# Altium schematic sheet USB.SchDoc
size 594 x 420 mm; SheetNumber: 8; PageSetup: Record=PageOptions|CenterHorizontal=False|CenterVertical=False|PrintScale=0.43|XCorrection=0.00|YCorrection=0.00|PrintKind=1|BorderSize=5000000|LeftOffset=0|BottomOffset=0|Orientation=2|PaperLength=5940|PaperWidth=4200|Scale=100|PaperSource=7|PrintQuality=-4|MediaType=1|DitherType=10|PaperKind=Personal. 1: 215,9 x 279,4 mm|PrintScaleMode=0
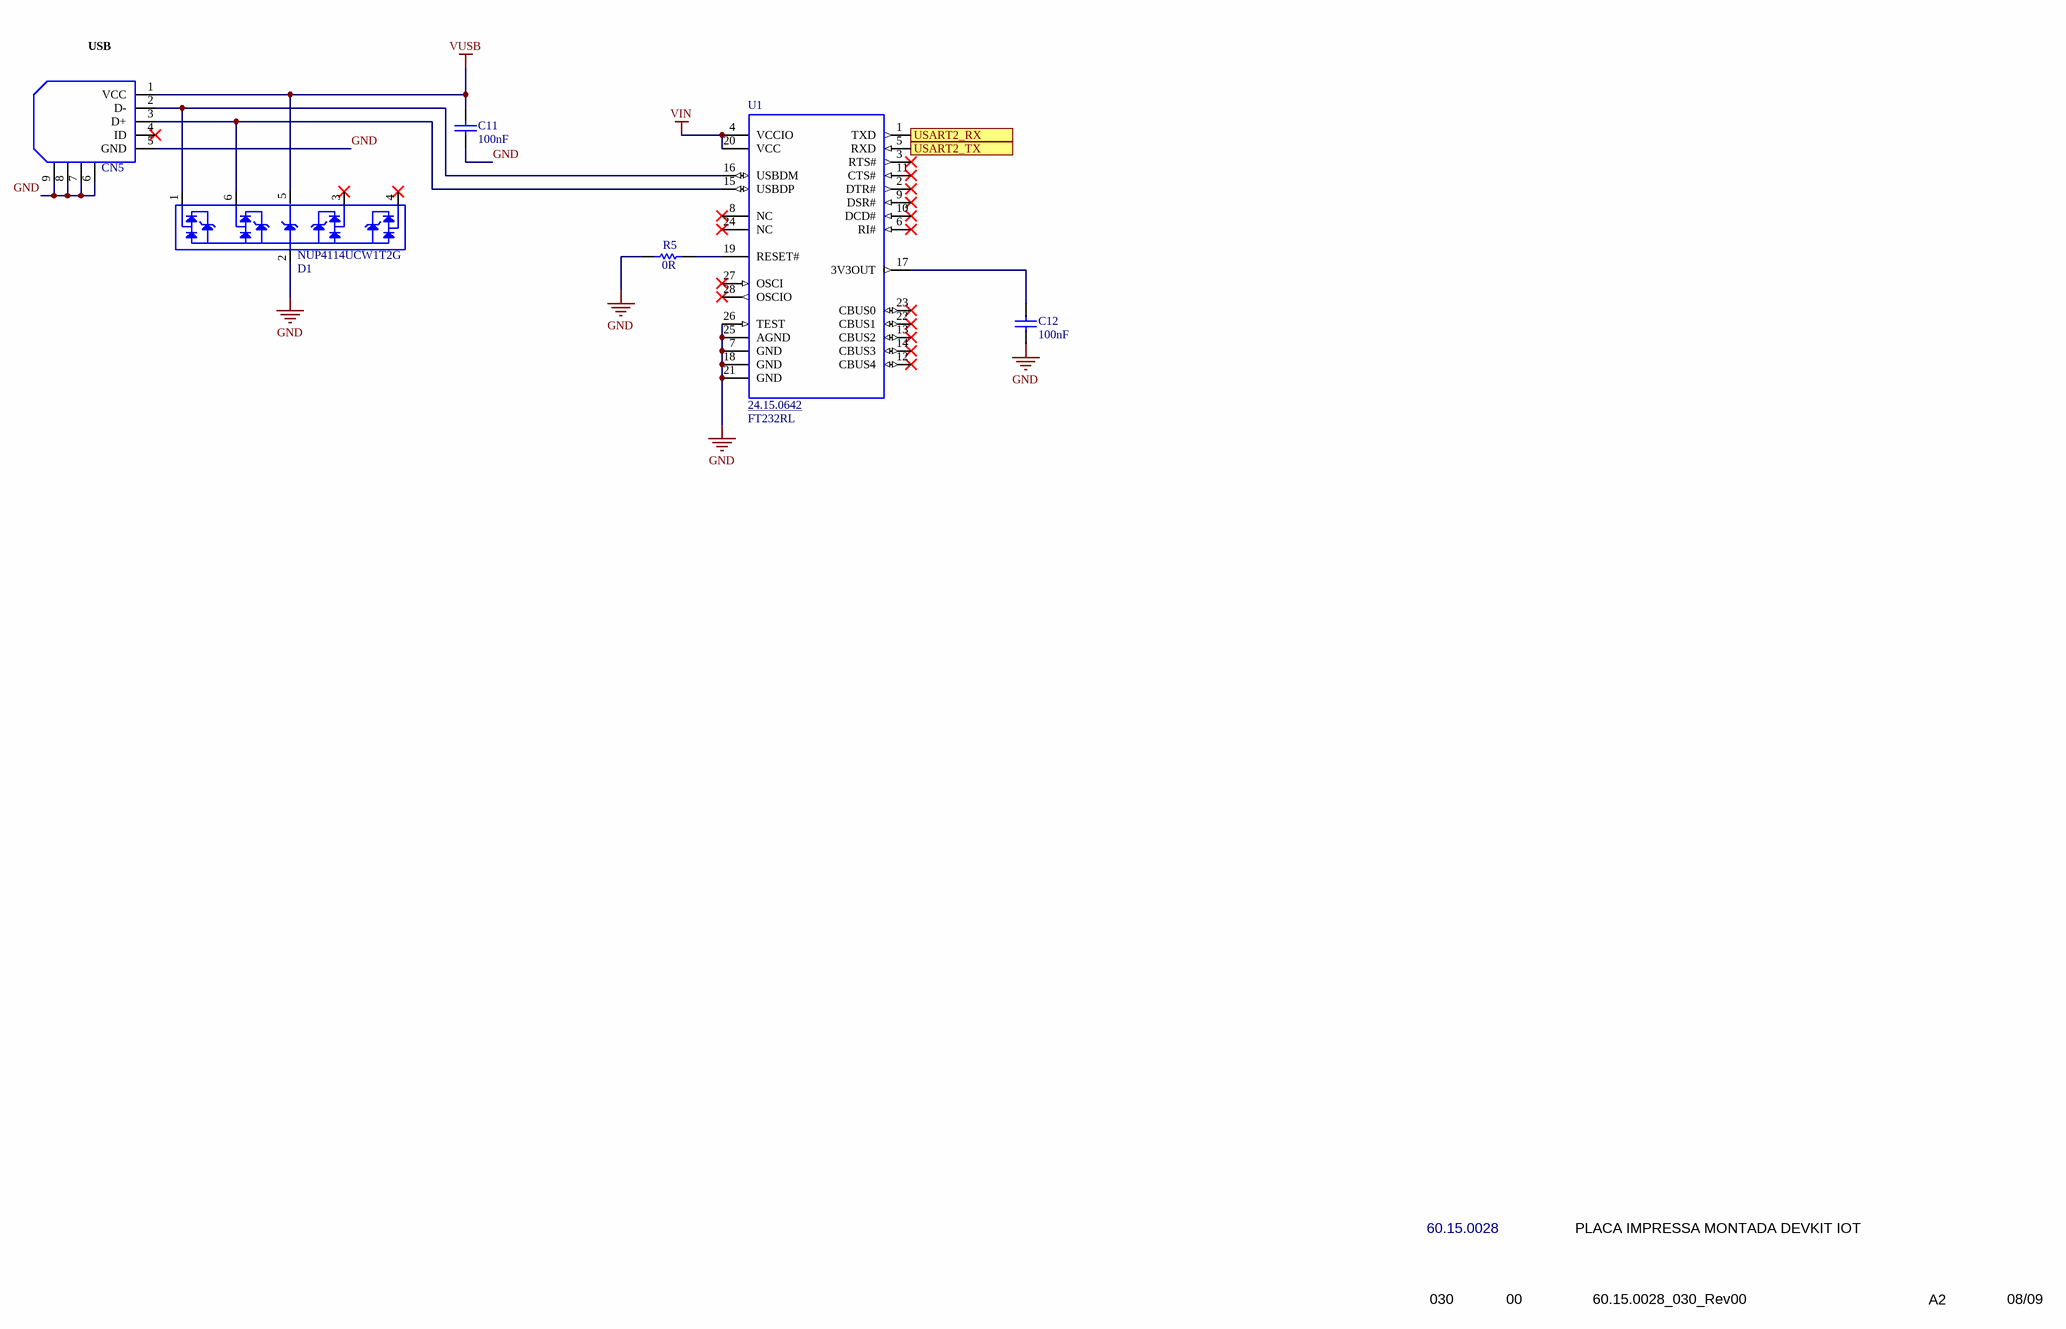
[diagram p0: USB.SchDoc]

## Parts
C11  16.23.0803  [16.23.0803]  (value not drawn)
C12  value 100nF  [16.23.0023]  (hidden comment: 16.23.0023)
CN5  28.14.0512  [28.14.0512]  (value not drawn)
D1  32.27.0043  [32.27.0043]  (value not drawn)
R5  value 0R  [66.24.1337]  (hidden comment: 66.24.1337)
U1  24.15.0642  Part Number: FT232RL  [24.15.0642]

## Ports
USART2_RX, USART2_TX

## Nets
GND: C11.1 C12.1 CN5.5(GND) CN5.6(SHIELD) CN5.7(SHIELD) CN5.8(SHIELD) CN5.9(SHIELD) D1.2 R5.1 U1.7(GND) U1.18(GND) U1.21(GND) U1.25(AGND) U1.26(TEST)
VIN: U1.4(VCCIO) U1.20(VCC)
VUSB: C11.2 CN5.1(VCC) D1.5
USART2_RX: U1.1(TXD) ; port USART2_RX
USART2_TX: U1.5(RXD) ; port USART2_TX
NetC12_2: C12.2 U1.17(3V3OUT)
NetCN5_2: CN5.2(D-) D1.1 U1.16(USBDM)
NetCN5_3: CN5.3(D+) D1.6 U1.15(USBDP)
NetR5_2: R5.2 U1.19(RESET#)

Not connected (* = marked no-connect by the designer): CN5 4(ID)*; D1 3* 4*; U1 2(DTR#)* 3(RTS#)* 6(RI#)* 8(NC)* 9(DSR#)* 10(DCD#)* 11(CTS#)* 12(CBUS4)* 13(CBUS2)* 14(CBUS3)* 22(CBUS1)* 23(CBUS0)* 24(NC)* 27(OSCI)* 28(OSCIO)*

## Notes on the sheet
- (near CN5) USB
- 60.15.0028
- PLACA IMPRESSA MONTADA DEVKIT IOT
- 030
- 00
- 60.15.0028_030_Rev00
- A2
- 08/09
- 1
- 2
- 3
- 4
- 5
- 6
- 7
- 8
- A
- B
- C
- D
- E
- F
- G
- H
- DOCUMENTO DE ENGENHARIA DE PRODUTO
- DOCUMENT OF PRODUCT ENGINEERING
- CÓDIGO / CODE
- DESCRIÇÃO / DESCRIPTION
- DOC
- REV
- ARQUIVO / FILE
- FORM./SIZE
- FOLHA / PAGE
- (in symbol 16.23.0803) 100nF
- (in symbol 32.27.0043) NUP4114UCW1T2G

## Library data of the parts
C11 = 16.23.0803: CAPACITOR CERAMICO 100nF 16V 10%% X5R SMD 0201
C12 = 16.23.0023: CC SMD 100NF 50V X7R 10% 0805
CN5 = 28.14.0512: CONN USB MICRO B RECPT SMT R/A; Value: 10118192-0001LF
D1 = 32.27.0043: DIODO SUPRESSOR 5.5V 10V SC88
R5 = 66.24.1337: RESISTOR THICK FILM 0,1W 0 OHMS SMD 0603
U1 = 24.15.0642: CID CONVERSOR USB PARA SERIAL SSOP-28; Manufactor: FTDI; Value: FT232RL